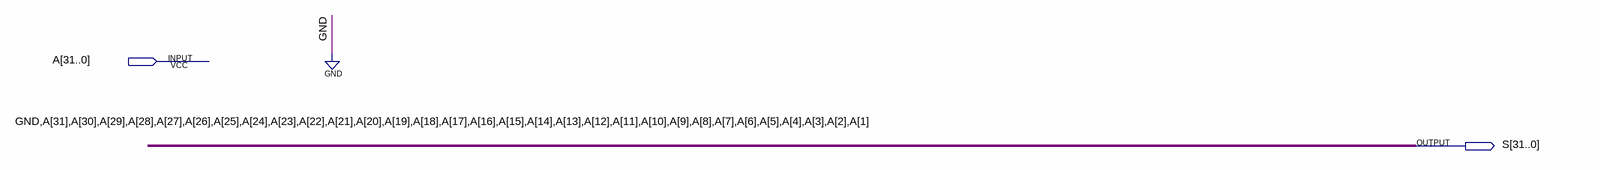
[diagram p0: schematic sheet]
// Quartus schematic SR1.bdf as structural Verilog: 0 symbols, 2 pins
module SR1 (
  input  [31:0] A,
  output [31:0] S
);


  assign S = {1'b0, A[31:1]};
endmodule
